# EasyEDA schematic SCH_teganganrendah_2024-07-17.json
TITLE: Sheet_1; REV: 1.0; Date: 2024-06-13; Sheet: 1/1; Drawn By: arisst77; Company: Your Company
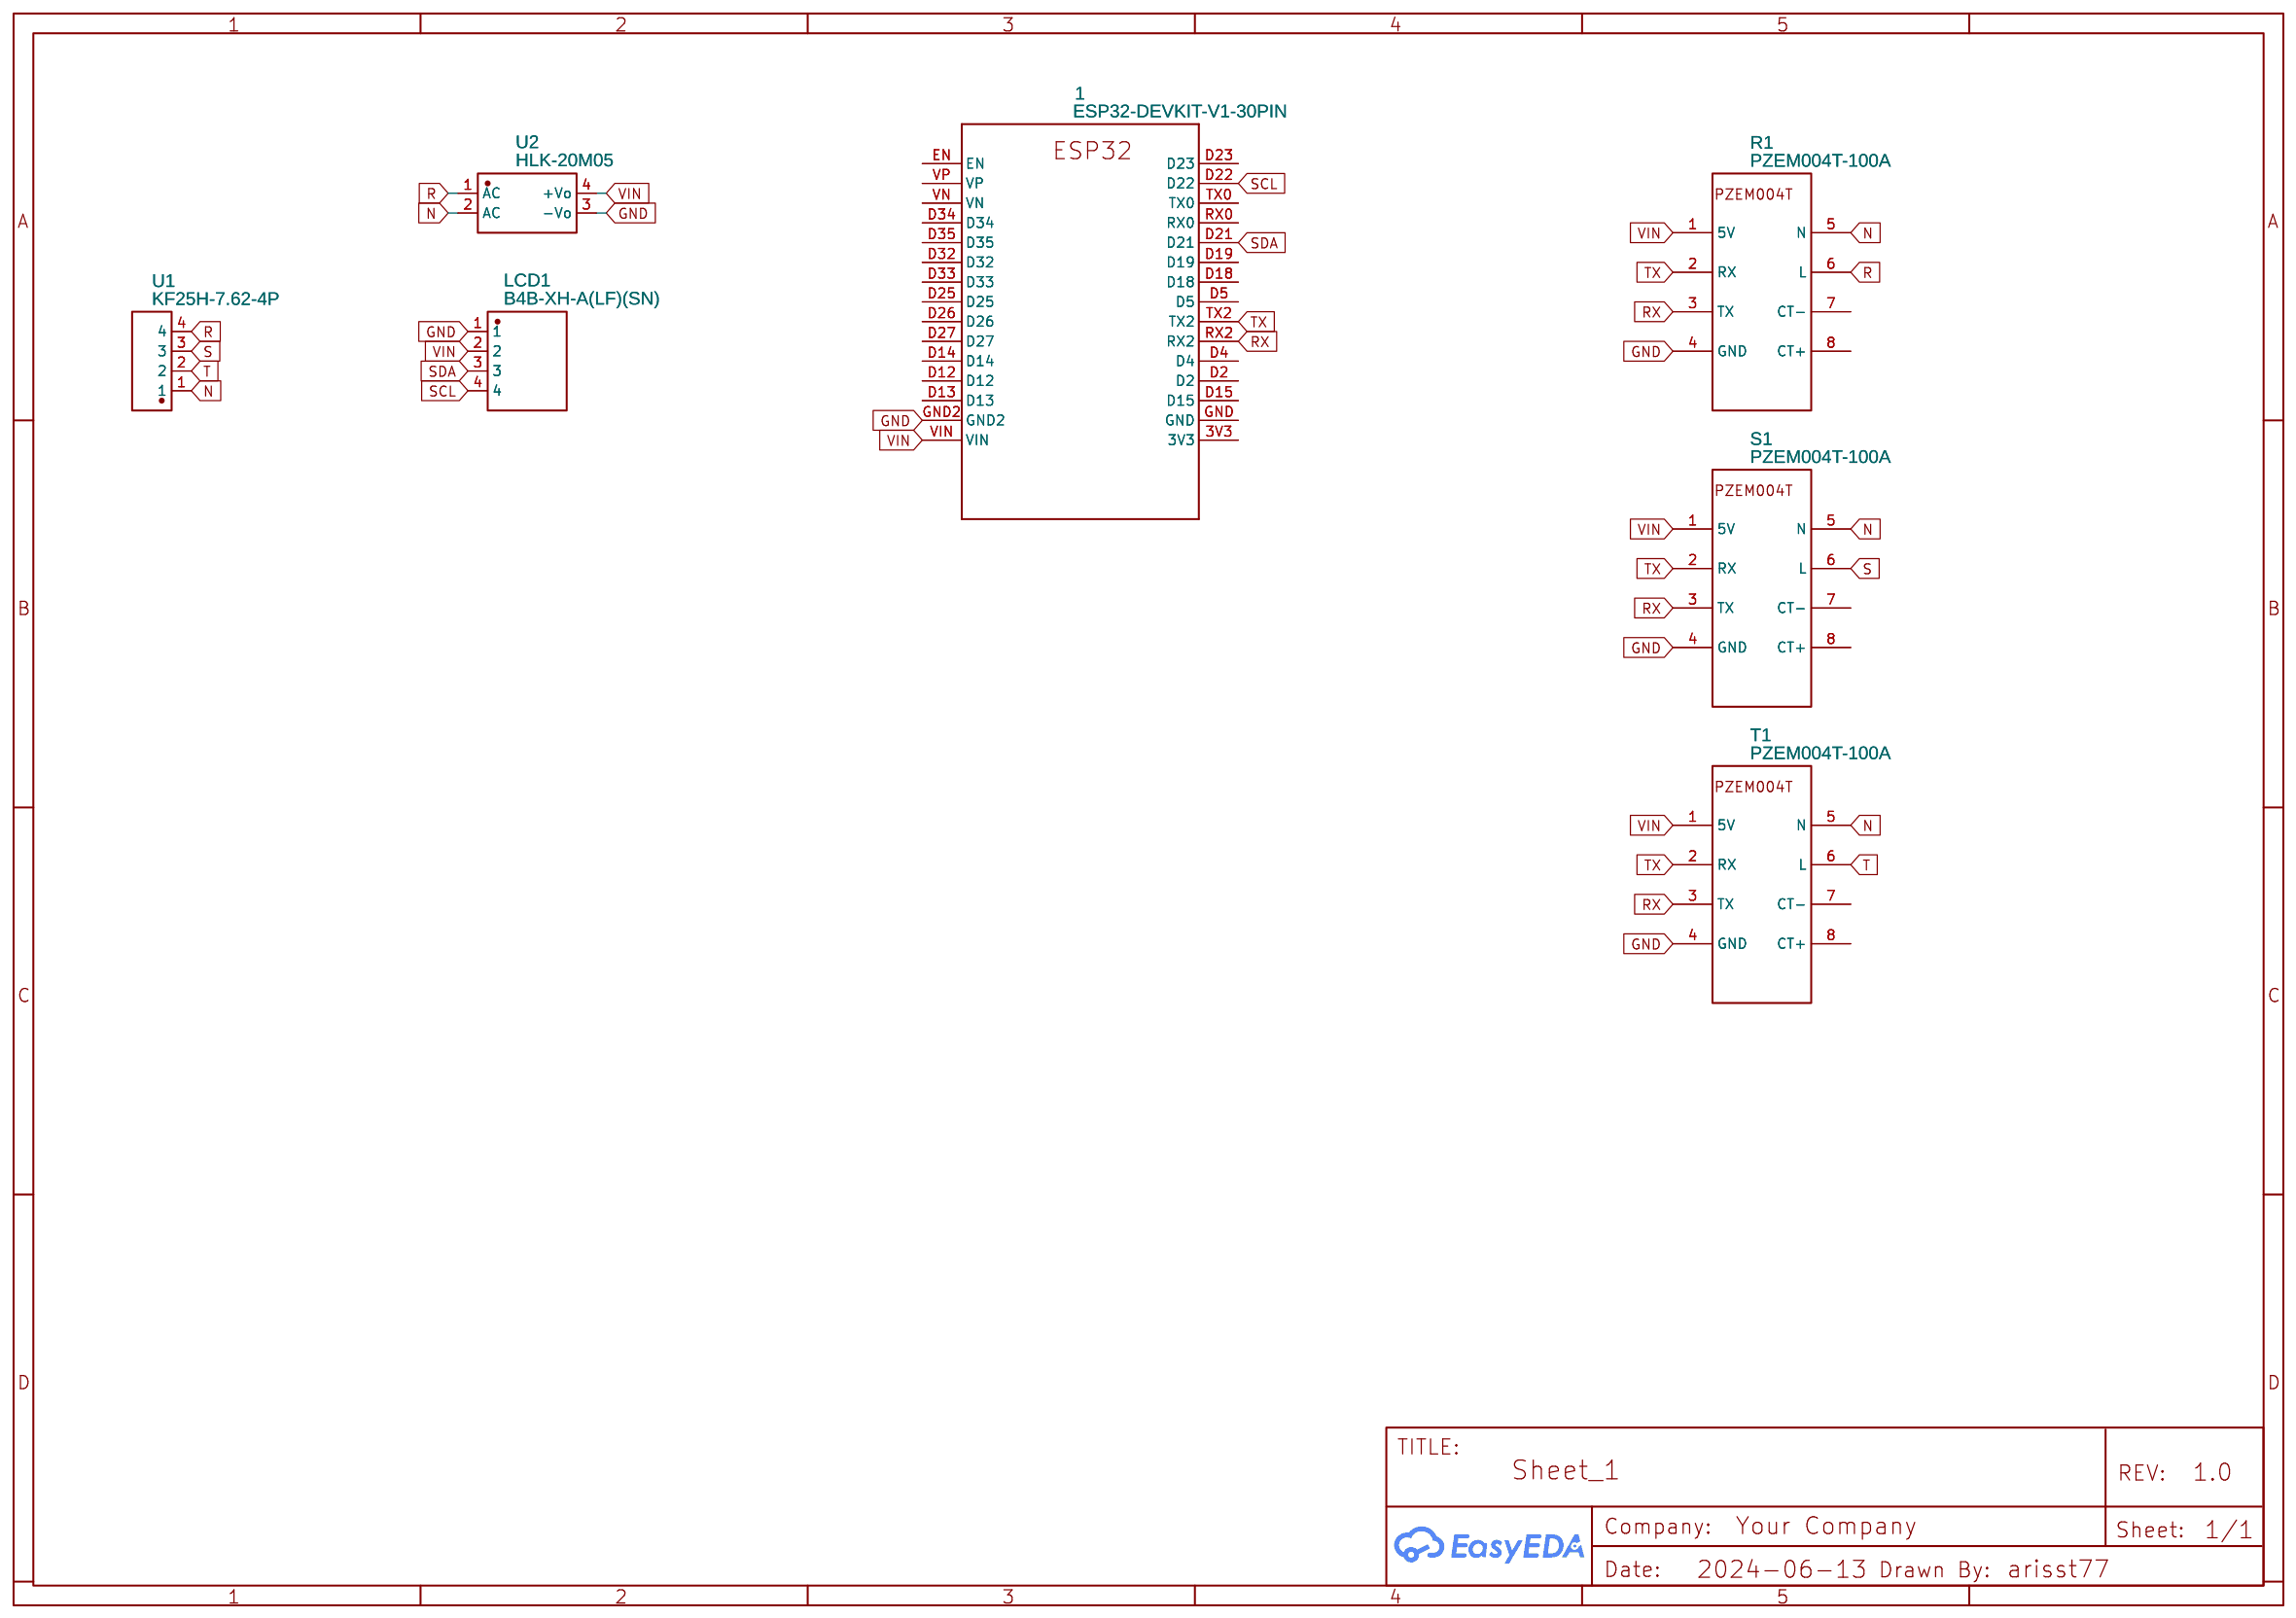
[diagram p0: schematic sheet]

## Parts
1  ESP32-DEVKIT-V1-30PIN  [ESP32-DEVKITV1_ESP32-DEVKITV1]
LCD1  B4B-XH-A(LF)(SN)  [CONN-TH_B4B-XH-A-LF-SN]
R1  PZEM004T-100A  [PZEM004T-100A]
S1  PZEM004T-100A  [PZEM004T-100A]
T1  PZEM004T-100A  [PZEM004T-100A]
U1  KF25H-7.62-4P  [CONN-TH_KF25H-7.62-4P]
U2  HLK-20M05  [PWRM-TH_HLK-20MXX]

## Library data of the parts
1 = ESP32-DEVKIT-V1-30PIN: Contributor: guritagurih
LCD1 = B4B-XH-A(LF)(SN): Contributor: LCSC; Supplier: LCSC; Supplier Part: C144395; Manufacturer: JST; JLCPCB Part Class: Extended Part
R1 S1 T1 = PZEM004T-100A: Manufacturer: Peacefair; Supplier: Peacefair; link: https://www.aliexpress.com/item/32707315880.html?spm=2114.12010615.8148356.6.571479231BK6rY; Contributor: ahmadtino
U1 = KF25H-7.62-4P: Contributor: LCSC; Supplier: LCSC; Supplier Part: C707375; Manufacturer: KEFA(科发); JLCPCB Part Class: Extended Part
U2 = HLK-20M05: Contributor: LCSC; Supplier: LCSC; Supplier Part: C465406; Manufacturer: HI-LINK(海凌科); JLCPCB Part Class: Extended Part

## Nets
GND: 1.GND2 LCD1.1 R1.4(GND) S1.4(GND) T1.4(GND) U2.3(-Vo)
VIN: 1.VIN LCD1.2 R1.1(5V) S1.1(5V) T1.1(5V) U2.4(+Vo)
N: R1.5(N) S1.5(N) T1.5(N) U1.1 U2.2(AC)
R: R1.6(L) U1.4 U2.1(AC)
RX: 1.RX2 R1.3(TX) S1.3(TX) T1.3(TX)
S: S1.6(L) U1.3
SCL: 1.D22 LCD1.4
SDA: 1.D21 LCD1.3
T: T1.6(L) U1.2
TX: 1.TX2 R1.2(RX) S1.2(RX) T1.2(RX)

Not connected (* = marked no-connect by the designer): 1 3V3 D2 D4 D5 D12 D13 D14 D15 D18 D19 D23 D25 D26 D27 D32 D33 D34 D35 EN GND RX0 TX0 VN VP; R1 7(CT-) 8(CT+); S1 7(CT-) 8(CT+); T1 7(CT-) 8(CT+)
